# Altium schematic sheet E-19 WIFI_BT_802.15.4.SchDoc: FRDM-IMX93
size 513 x 386 mm; DrawnBy: FORLINX; Organization: ORGANIZATION; Address1: ADDRESS 1; Address2: ADDRESS 2; Address3: ADDRESS 3; Address4: ADDRESS 4; Revision: -; ENG_APP_DATE: --/--/--; DSN_APP_DATE: --/--/--; CHK_APP_DATE: --/--/--; Classification: Public, Company Internal/Proprietary, Company Confidential,  Company Secret; Page Create Date: March  8, 1995; OrgName: NXP Semiconductor; FIUO: A; OrgAddr1: NO. 192 Liangjing Rd. Pudong New Area, ShangHai; Page Number: 19; PageTitle: WIFI/BT/802.15.4; Page Size: C; Page Count: 23; Designer: FORLINX; RevCode: B1; Approver: NXP SE; Doc: SCH-94611 PDF: SPF-94611; DsnPath: T:\FILES\Designs\Single Board Computers\i.MX93-FRDM\Design Files\SCH-94611_B1.DSN; SchematicName: FRDM-i.MX 93 Development Board; PageName: E-19 WIFI/BT/802.15.4; PageSize: C; TopSchematic: True
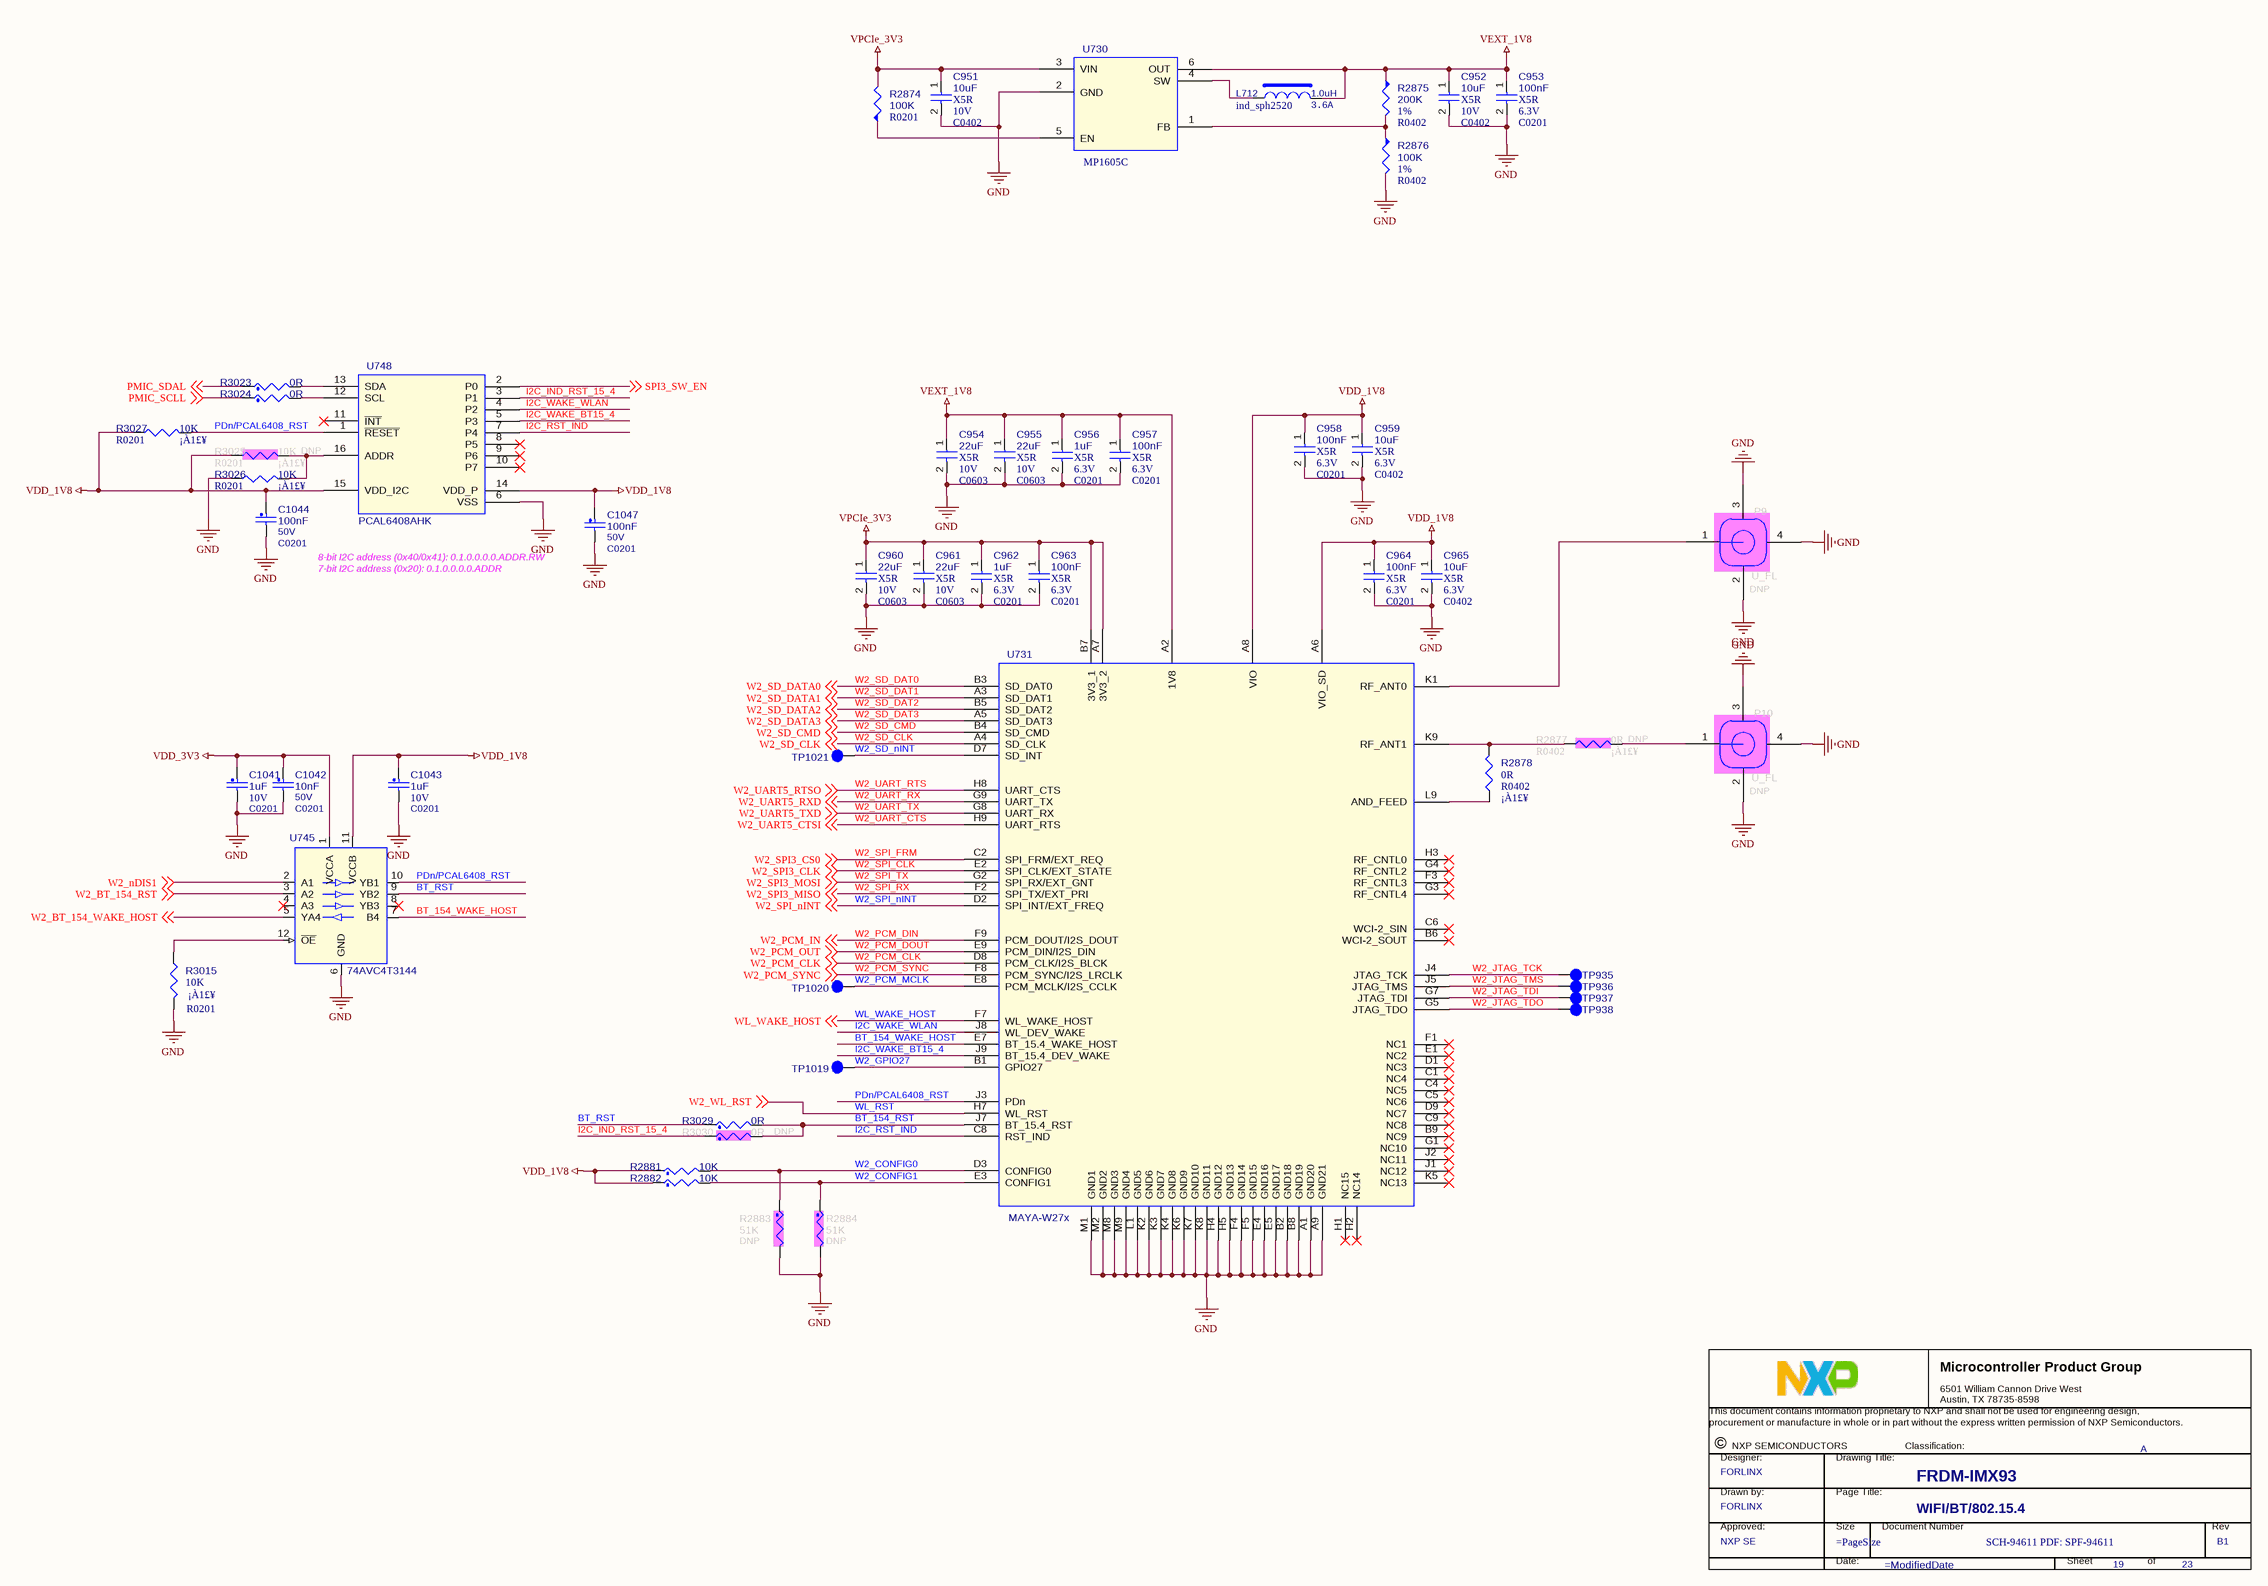
[diagram p0: E-19 WIFI_BT_802.15.4.SchDoc]

## Parts
*  Title: FRDM-IMX93  RevCode: B1  PageTitle: WIFI/BT/802.15.4  Page Number: 19  Page Count: 23  DrawnBy: FORLINX  Doc: SCH-94611 PDF: SPF-94611  Approver: NXP SE  FIUO: A  (graphical)
C951  10uF  Voltage: 10V  Dielectric: X5R  [C0402]
C952  10uF  Voltage: 10V  Dielectric: X5R  [C0402]
C953  100nF  Voltage: 6.3V  Dielectric: X5R  [C0201]
C954  22uF  Voltage: 10V  Dielectric: X5R  [C0603]
C955  22uF  Voltage: 10V  Dielectric: X5R  [C0603]
C956  1uF  Voltage: 6.3V  Dielectric: X5R  [C0201]
C957  100nF  Voltage: 6.3V  Dielectric: X5R  [C0201]
C958  100nF  Voltage: 6.3V  Dielectric: X5R  [C0201]
C959  10uF  Voltage: 6.3V  Dielectric: X5R  [C0402]
C960  22uF  Voltage: 10V  Dielectric: X5R  [C0603]
C961  22uF  Voltage: 10V  Dielectric: X5R  [C0603]
C962  1uF  Voltage: 6.3V  Dielectric: X5R  [C0201]
C963  100nF  Voltage: 6.3V  Dielectric: X5R  [C0201]
C964  100nF  Voltage: 6.3V  Dielectric: X5R  [C0201]
C965  10uF  Voltage: 6.3V  Dielectric: X5R  [C0402]
C1041  1uF  VOLTAGE: 10V  [C0201]
C1042  10nF  VOLTAGE: 50V  [C0201]
C1043  1uF  VOLTAGE: 10V  [C0201]
C1044  100nF  VOLTAGE: 50V  [C0201]
C1047  100nF  VOLTAGE: 50V  [C0201]
L712  1.0uH  Isat: 3.6A  [ind_sph2520]
P9  U_FL  ASSY_OPT: DNP  [IPEX_4]
P10  U_FL  ASSY_OPT: DNP  [IPEX_4]
R2874  100K  [R0201]
R2875  200K  Tolerance: 1%  [R0402]
R2876  100K  Tolerance: 1%  [R0402]
R2877  0R  precision: ¡À1£¥  ASSY_OPT: DNP  [R0402]
R2878  0R  precision: ¡À1£¥  [R0402]
R2881  10K  [R0201]
R2882  10K  [R0201]
R2883  51K  ASSY_OPT: DNP  [R0201]
R2884  51K  ASSY_OPT: DNP  [R0201]
R3015  10K  precision: ¡À1£¥  [R0201]
R3023  0R  [R0201]
R3024  0R  [R0201]
R3025  10K  precision: ¡À1£¥  ASSY_OPT: DNP  [R0201]
R3026  10K  precision: ¡À1£¥  [R0201]
R3027  10K  precision: ¡À1£¥  [R0201]
R3029  0R  [R0201]
R3030  0R  ASSY_OPT: DNP  [R0201]
TP935  TPAD_015  [tpad_015]  (value not drawn)
TP936  TPAD_015  [tpad_015]  (value not drawn)
TP937  TPAD_015  [tpad_015]  (value not drawn)
TP938  TPAD_015  [tpad_015]  (value not drawn)
TP1019  TPAD_015  [tpad_015]  (value not drawn)
TP1020  TPAD_015  [tpad_015]  (value not drawn)
TP1021  TPAD_015  [tpad_015]  (value not drawn)
U730  MP1605C  [SOT563]
U731  MAYA-W27x  [MAYA-W2]
U745  74AVC4T3144  [uqfn12_1p7x2mm]
U748  PCAL6408AHK  [XQFN16]

## Nets
GND: C951.2 C952.2 C953.2 C954.2 C955.2 C956.2 C957.2 C958.2 C959.2 C960.2 C961.2 C962.2 C963.2 C964.2 C965.2 C1041.2 C1042.2 C1043.2 C1044.2 C1047.2 P9.2 P9.3 P9.4 P10.2 P10.3 P10.4 R2876.2 R2883.2 R2884.2 R3015.2 R3026.1 U730.2(GND) U731.A1(GND20) U731.A9(GND21) U731.B2(GND18) U731.B8(GND19) U731.E4(GND16) U731.E5(GND17) U731.F4(GND14) U731.F5(GND15) U731.H4(GND12) U731.H5(GND13) U731.K2(GND6) U731.K3(GND7) U731.K4(GND8) U731.K6(GND9) U731.K7(GND10) U731.K8(GND11) U731.L1(GND5) U731.M1(GND1) U731.M2(GND2) U731.M8(GND3) U731.M9(GND4) U745.6(GND) U748.6(VSS)
VDD_1V8: C958.1 C959.1 C964.1 C965.1 C1043.1 C1044.1 C1047.1 R2881.1 R2882.1 R3025.1 R3027.1 U731.A6(VIO_SD) U731.A8(VIO) U745.11(VCCB) U748.14(VDD_P) U748.15(VDD_I2C)
VDD_3V3: C1041.1 C1042.1 U745.1(VCCA)
VEXT_1V8: C952.1 C953.1 C954.1 C955.1 C956.1 C957.1 L712.2 R2875.1 U730.6(OUT) U731.A2(1V8)
VPCIe_3V3: C951.1 C960.1 C961.1 C962.1 C963.1 R2874.2 U730.3(VIN) U731.A7(3V3_2) U731.B7(3V3_1)
BT_154_RST: R3029.2 R3030.2 U731.J7(BT_15.4_RST)
BT_154_WAKE_HOST: U731.E7(BT_15.4_WAKE_HOST) U745.7(B4)
BT_RST: R3029.1 U745.9(YB2)
I2C_IND_RST_15_4: R3030.1 U748.3(P1)
I2C_RST_IND: U731.C8(RST_IND) U748.7(P4)
I2C_WAKE_BT15_4: U731.J9(BT_15.4_DEV_WAKE) U748.5(P3)
I2C_WAKE_WLAN: U731.J8(WL_DEV_WAKE) U748.4(P2)
PDn/PCAL6408_RST: R3027.2 U731.J3(PDn) U745.10(YB1) U748.1(~{RESET})
PMIC_SCLL: R3024.1 ; off-sheet PMIC_SCLL
PMIC_SDAL: R3023.1 ; off-sheet PMIC_SDAL
SPI3_SW_EN: U748.2(P0) ; off-sheet SPI3_SW_EN
W2_BT_154_RST: U745.3(A2) ; off-sheet W2_BT_154_RST
W2_BT_154_WAKE_HOST: U745.5(YA4) ; off-sheet W2_BT_154_WAKE_HOST
W2_CONFIG0: R2881.2 R2883.1 U731.D3(CONFIG0)
W2_CONFIG1: R2882.2 R2884.1 U731.E3(CONFIG1)
W2_GPIO27: TP1019.1(Pin1) U731.B1(GPIO27)
W2_JTAG_TCK: TP935.1(Pin1) U731.J4(JTAG_TCK)
W2_JTAG_TDI: TP937.1(Pin1) U731.G7(JTAG_TDI)
W2_JTAG_TDO: TP938.1(Pin1) U731.G5(JTAG_TDO)
W2_JTAG_TMS: TP936.1(Pin1) U731.J5(JTAG_TMS)
W2_nDIS1: U745.2(A1) ; off-sheet W2_nDIS1
W2_PCM_CLK: U731.D8(PCM_CLK/I2S_BLCK) ; off-sheet W2_PCM_CLK
W2_PCM_DIN: U731.F9(PCM_DOUT/I2S_DOUT) ; off-sheet W2_PCM_IN  [also labelled W2_PCM_IN]
W2_PCM_DOUT: U731.E9(PCM_DIN/I2S_DIN) ; off-sheet W2_PCM_OUT  [also labelled W2_PCM_OUT]
W2_PCM_MCLK: TP1020.1(Pin1) U731.E8(PCM_MCLK/I2S_CCLK)
W2_PCM_SYNC: U731.F8(PCM_SYNC/I2S_LRCLK) ; off-sheet W2_PCM_SYNC
W2_SD_CLK: U731.A4(SD_CLK) ; off-sheet W2_SD_CLK
W2_SD_CMD: U731.B4(SD_CMD) ; off-sheet W2_SD_CMD
W2_SD_DAT0: U731.B3(SD_DAT0) ; off-sheet W2_SD_DATA0  [also labelled W2_SD_DATA0]
W2_SD_DAT1: U731.A3(SD_DAT1) ; off-sheet W2_SD_DATA1  [also labelled W2_SD_DATA1]
W2_SD_DAT2: U731.B5(SD_DAT2) ; off-sheet W2_SD_DATA2  [also labelled W2_SD_DATA2]
W2_SD_DAT3: U731.A5(SD_DAT3) ; off-sheet W2_SD_DATA3  [also labelled W2_SD_DATA3]
W2_SD_nINT: TP1021.1(Pin1) U731.D7(SD_INT)
W2_SPI_CLK: U731.E2(SPI_CLK/EXT_STATE) ; off-sheet W2_SPI3_CLK  [also labelled W2_SPI3_CLK]
W2_SPI_FRM: U731.C2(SPI_FRM/EXT_REQ) ; off-sheet W2_SPI3_CS0  [also labelled W2_SPI3_CS0]
W2_SPI_nINT: U731.D2(SPI_INT/EXT_FREQ) ; off-sheet W2_SPI_nINT
W2_SPI_RX: U731.F2(SPI_TX/EXT_PRI) ; off-sheet W2_SPI3_MISO  [also labelled W2_SPI3_MISO]
W2_SPI_TX: U731.G2(SPI_RX/EXT_GNT) ; off-sheet W2_SPI3_MOSI  [also labelled W2_SPI3_MOSI]
W2_UART_CTS: U731.H9(UART_RTS) ; off-sheet W2_UART5_CTSI  [also labelled W2_UART5_CTSI]
W2_UART_RTS: U731.H8(UART_CTS) ; off-sheet W2_UART5_RTSO  [also labelled W2_UART5_RTSO]
W2_UART_RX: U731.G9(UART_TX) ; off-sheet W2_UART5_RXD  [also labelled W2_UART5_RXD]
W2_UART_TX: U731.G8(UART_RX) ; off-sheet W2_UART5_TXD  [also labelled W2_UART5_TXD]
WL_RST: U731.H7(WL_RST) ; off-sheet W2_WL_RST  [also labelled W2_WL_RST]
WL_WAKE_HOST: U731.F7(WL_WAKE_HOST) ; off-sheet WL_WAKE_HOST
NetL712_1: L712.1 U730.4(SW)
NetP9_1: P9.1 U731.K1(RF_ANT0)
NetP10_1: P10.1 R2877.2
NetR2874_1: R2874.1 U730.5(EN)
NetR2875_2: R2875.2 R2876.1 U730.1(FB)
NetR2877_1: R2877.1 R2878.2 U731.K9(RF_ANT1)
NetR2878_1: R2878.1 U731.L9(AND_FEED)
NetR3015_1: R3015.1 U745.12(~{OE})
NetR3023_2: R3023.2 U748.13(SDA)
NetR3024_2: R3024.2 U748.12(SCL)
NetR3025_2: R3025.2 R3026.2 U748.16(ADDR)

Not connected (* = marked no-connect by the designer): U731 B6(WCI-2_SOUT)* B9(NC9)* C1(NC4)* C4(NC5)* C5(NC6)* C6(WCI-2_SIN)* C9(NC8)* D1(NC3)* D9(NC7)* E1(NC2)* F1(NC1)* F3(RF_CNTL3)* G1(NC10)* G3(RF_CNTL4)* G4(RF_CNTL2)* H1(NC15)* H2(NC14)* H3(RF_CNTL0)* J1(NC12)* J2(NC11)* K5(NC13)*; U745 4(A3)* 8(YB3)*; U748 8(P5)* 9(P6)* 10(P7)* 11(~{INT})*

## Notes on the sheet
- 8-bit I2C address (0x40/0x41): 0.1.0.0.0.0.ADDR.RW
- 7-bit I2C address (0x20): 0.1.0.0.0.0.ADDR
- DWG. NO.
- REV.
- SHT.
- REVISION
- DESCRIPTION
- DATE
- APPROVED
- ENG:
- APPROVALS
- quilter.ai <http://quilter.ai>
- DSN:
- CHK:
- REFERENCE DOCUMENTS
- TITLE
- PROJECT
- BOM:
- FAB DWG:
- PCB DWG:
- ASSY DWG:
- SIZE
- FILE NAME
- C
- DWG NO.
- SHEET
- OF
- REV
- (in symbol TitleBlock_MCPG) Microcontroller Product Group; 6501 William Cannon Drive West / Austin, TX 78735-8598; This document contains information proprietary to NXP and shall not be used for engineering design,; procurement or manufacture in whole or in part without the express written permission of NXP Semiconductors.; ©; NXP SEMICONDUCTORS; Classification:; Designer:; Drawing Title:; Drawn by:; Page Title:; Approved:; Size; Document Number; Rev; Date:; Sheet; of

## Library data of the parts
* = TitleBlock_MCPG: Classification: Public, Company Internal/Proprietary, Company Confidential,  Company Secret; OrgAddr1: NO. 192 Liangjing Rd. Pudong New Area, ShangHai; OrgName: NXP Semiconductor; Page Size: =PageSize; Page Create Date: March  8, 1995; Designer: FORLINX; Page Modify Date: =ModifiedDate
C951 = CAP NP: 0402,10uF,6.3V,+/-20%,X5R; Part Reference: C951; Manufacturer PN: GRM188R61A106MAAL; Manufacturer: murata; MFG_PN01: 0402X106M6R3NT; Tolerance: ¡À20%; Priority: A; RK PN: 902003487; MFG_NAME01: FENGHUA; PCB Footprint: C0402; Value: 10uF; Created by: JJJ; C_Voltage: 6.3V; Part Type: Ò»°ãÓÃÆ¬×´ÌÕ´ÉµçÈÝ
C952 = CAP NP: 0402,10uF,6.3V,+/-20%,X5R; Part Reference: C952; Manufacturer PN: GRM188R61A106MAAL; Manufacturer: murata; MFG_PN01: 0402X106M6R3NT; Tolerance: ¡À20%; Priority: A; RK PN: 902003487; MFG_NAME01: FENGHUA; PCB Footprint: C0402; Value: 10uF; Created by: JJJ; C_Voltage: 6.3V; Part Type: Ò»°ãÓÃÆ¬×´ÌÕ´ÉµçÈÝ
C953 = CAP NP: 0201,100nF,25V,+/-10%,X5R; Part Reference: C953; Manufacturer: FH(·ç»ª); Manufacturer PN: 0402X104K6R3NT; MFG_PN01: 0201X104K250NT; RK PN: 902004347; Priority: A; Tolerance: ¡À10%; MFG_NAME01: FENGHUA; PCB Footprint: C0201; Value: 100nF; Part Type: Ò»°ãÓÃÆ¬×´ÌÕ´ÉµçÈÝ; Created by: JJJ
C954 = CAP NP: 0603,22uF,6.3V,+/-20%,X5R; Part Reference: C954; Manufacturer PN: C2012X5R1A226K125AB; Manufacturer: TDK; MFG_PN01: CL10A226MQ8NRNC; Tolerance: 10%; Priority: A; MFG_NAME01: SAMSUNG; PCB Footprint: C0603; Value: 22uF; Created by: JJJ; C_Voltage: 6.3V; Part Type: C0805; RK PN: C2012X5R1A226K125AB
C955 = CAP NP: 0603,22uF,6.3V,+/-20%,X5R; Part Reference: C955; Manufacturer PN: C2012X5R1A226K125AB; Manufacturer: TDK; MFG_PN01: CL10A226MQ8NRNC; Tolerance: 10%; Priority: A; MFG_NAME01: SAMSUNG; PCB Footprint: C0603; Value: 22uF; Created by: JJJ; C_Voltage: 6.3V; Part Type: C0805; RK PN: C2012X5R1A226K125AB
C956 = CAP NP: 0201,1uF,10V,+/-20%,X5R; Part Reference: C956; Manufacturer PN: 0402X104K6R3NT; Manufacturer: FH(·ç»ª); MFG_PN01: CL03A105MP3NSNC; Tolerance: ¡À10%; Priority: A; RK PN: 902004347; MFG_NAME01: SAMSUNG; PCB Footprint: C0201; Value: 1uF; Created by: JJJ; Part Type: Ò»°ãÓÃÆ¬×´ÌÕ´ÉµçÈÝ
C957 = CAP NP: 0201,100nF,25V,+/-10%,X5R; Part Reference: C957; Manufacturer: FH(·ç»ª); Manufacturer PN: 0402X104K6R3NT; MFG_PN01: 0201X104K250NT; RK PN: 902004347; Priority: A; Tolerance: ¡À10%; MFG_NAME01: FENGHUA; PCB Footprint: C0201; Value: 100nF; Part Type: Ò»°ãÓÃÆ¬×´ÌÕ´ÉµçÈÝ; Created by: JJJ
C958 = CAP NP: 0201,100nF,25V,+/-10%,X5R; Part Reference: C958; Manufacturer PN: 0402X104K6R3NT; Manufacturer: FH(·ç»ª); MFG_PN01: 0201X104K250NT; Tolerance: ¡À10%; Priority: A; RK PN: 902004347; MFG_NAME01: FENGHUA; PCB Footprint: C0201; Value: 100nF; Created by: JJJ; Part Type: Ò»°ãÓÃÆ¬×´ÌÕ´ÉµçÈÝ
C959 = CAP NP: 0402,10uF,6.3V,+/-20%,X5R; Part Reference: C959; Manufacturer PN: 0402X104K6R3NT; Manufacturer: FH(·ç»ª); MFG_PN01: 0402X106M6R3NT; Tolerance: ¡À10%; Priority: A; RK PN: 902004347; MFG_NAME01: FENGHUA; PCB Footprint: C0402; Value: 10uF; Created by: JJJ; Part Type: Ò»°ãÓÃÆ¬×´ÌÕ´ÉµçÈÝ
C960 = CAP NP: 0603,22uF,6.3V,+/-20%,X5R; Part Reference: C960; Manufacturer PN: C2012X5R1A226K125AB; Manufacturer: TDK; MFG_PN01: CL10A226MQ8NRNC; Tolerance: 10%; Priority: A; MFG_NAME01: SAMSUNG; PCB Footprint: C0603; Value: 22uF; Created by: JJJ; C_Voltage: 6.3V; Part Type: C0805; RK PN: C2012X5R1A226K125AB
C961 = CAP NP: 0603,22uF,6.3V,+/-20%,X5R; Part Reference: C961; Manufacturer PN: C2012X5R1A226K125AB; Manufacturer: TDK; MFG_PN01: CL10A226MQ8NRNC; Tolerance: 10%; Priority: A; MFG_NAME01: SAMSUNG; PCB Footprint: C0603; Value: 22uF; Created by: JJJ; C_Voltage: 6.3V; Part Type: C0805; RK PN: C2012X5R1A226K125AB
C962 = CAP NP: 0201,1uF,10V,+/-20%,X5R; Part Reference: C962; Manufacturer: FH(·ç»ª); Manufacturer PN: 0402X104K6R3NT; MFG_PN01: CL03A105MP3NSNC; RK PN: 902004347; Priority: A; Tolerance: ¡À10%; MFG_NAME01: SAMSUNG; PCB Footprint: C0201; Value: 1uF; Part Type: Ò»°ãÓÃÆ¬×´ÌÕ´ÉµçÈÝ; Created by: JJJ
C963 = CAP NP: 0201,100nF,25V,+/-10%,X5R; Part Reference: C963; Manufacturer: FH(·ç»ª); Manufacturer PN: 0402X104K6R3NT; MFG_PN01: 0201X104K250NT; RK PN: 902004347; Priority: A; Tolerance: ¡À10%; MFG_NAME01: FENGHUA; PCB Footprint: C0201; Value: 100nF; Part Type: Ò»°ãÓÃÆ¬×´ÌÕ´ÉµçÈÝ; Created by: JJJ
C964 = CAP NP: 0201,100nF,25V,+/-10%,X5R; Part Reference: C964; Manufacturer PN: 0402X104K6R3NT; Manufacturer: FH(·ç»ª); MFG_PN01: 0201X104K250NT; Tolerance: ¡À10%; Priority: A; RK PN: 902004347; MFG_NAME01: FENGHUA; PCB Footprint: C0201; Value: 100nF; Created by: JJJ; Part Type: Ò»°ãÓÃÆ¬×´ÌÕ´ÉµçÈÝ
C965 = CAP NP: 0402,10uF,6.3V,+/-20%,X5R; Part Reference: C965; Manufacturer PN: 0402X104K6R3NT; Manufacturer: FH(·ç»ª); MFG_PN01: 0402X106M6R3NT; Tolerance: ¡À10%; Priority: A; RK PN: 902004347; MFG_NAME01: FENGHUA; PCB Footprint: C0402; Value: 10uF; Created by: JJJ; Part Type: Ò»°ãÓÃÆ¬×´ÌÕ´ÉµçÈÝ
C1041 = CAP_NP: 0201,1uF,10V,+/-20%,X5R; Part Reference: C1041; CLASS: DISCRETE; TOL: 10%; FPLIST: CC0402_25,CC0402_HD,0402_CC,capc0402_l; CAD_APPROVED: Yes; MFG_PN01: CL03A105MP3NSNC; MFG_NAME01: SAMSUNG; SIGNAL_MODEL: DEFAULT_CAPACITOR_1e+06pF_2_1; Value: 1uF; PCB Footprint: C0201; voltage rating: 10V; HEIGHT: 0.55 MM; ROHS: Yes; Tolerance: 10%
C1042 = CAP_NP: 0201,10nF,25V,+/-10%,X7R; Part Reference: C1042; CLASS: DISCRETE; FPLIST: CC0402_25,CC0402_HD,0402_CC; CAD_APPROVED: Yes; MFG_PN01: 0201B103K250NT; MFG_NAME01: FENGHUA; Tolerance: 10%; Value: 10nF; PCB Footprint: C0201; HEIGHT: 0.74 MM; ROHS: Yes
C1043 = CAP_NP: 0201,1uF,10V,+/-20%,X5R; Part Reference: C1043; CLASS: DISCRETE; TOL: 10%; FPLIST: CC0402_25,CC0402_HD,0402_CC,capc0402_l; CAD_APPROVED: Yes; MFG_PN01: CL03A105MP3NSNC; MFG_NAME01: SAMSUNG; SIGNAL_MODEL: DEFAULT_CAPACITOR_1e+06pF_2_1; Value: 1uF; PCB Footprint: C0201; voltage rating: 10V; HEIGHT: 0.55 MM; ROHS: Yes; Tolerance: 10%
C1044 = CAP_NP: 0201,100nF,25V,+/-10%,X5R; Part Reference: C1044; CLASS: DISCRETE; Tolerance: 10%; MFG_NAME01: FENGHUA; MFG_PN01: 0201X104K250NT; CAD_APPROVED: Yes; FPLIST: CC0402_25,CC0402_HD,0402_CC; Value: 100nF; PCB Footprint: C0201; ROHS: Yes; HEIGHT: 0.74 MM
C1047 = CAP_NP: 0201,100nF,25V,+/-10%,X5R; Part Reference: C1047; CLASS: DISCRETE; FPLIST: CC0402_25,CC0402_HD,0402_CC; CAD_APPROVED: Yes; MFG_PN01: 0201X104K250NT; MFG_NAME01: FENGHUA; Tolerance: 10%; Value: 100nF; PCB Footprint: C0201; HEIGHT: 0.74 MM; ROHS: Yes
L712 = INDUCTORS OF FERRITE: 1uH ,2.5*2.0*1.2mm, 3.6A; Part Reference: L712; Manufacturer: TDK; DC Resistor: 0.065ohm; MFG_PN01: WPN252012H1R0MT; RK PN: VLS252010HBX-1R0M; Priority: A; Tolerance: 20%; Irms: 2.55A; Resonace frequency: 1MHz; MFG_NAME01: Sunlord; PCB Footprint: ind_sph2520; Value: 1.0uH; Part Type: IND; Manufacturer PN: VLS252010HBX-1R0M; Created by: JJJ
P9 = U_FL: IPEX transposon, 4th generation; Part Reference: P9; MFG_PN01: IPEX-4; MFG_NAME01: IPES; Value: U_FL; PCB Footprint: IPEX_4
P10 = U_FL: IPEX transposon, 4th generation; Part Reference: P10; MFG_PN01: IPEX-4; MFG_NAME01: IPES; Value: U_FL; PCB Footprint: IPEX_4
R2874 = RESISTOR5: 0201,100K,+/-1%; Part Reference: R2874; Manufacturer: YAGEO; Manufacturer PN: RC0402JR-07100KL; Tolerance: 5%; MFG_PN01: RC-01W1003FT; RK PN: 901001447; Priority: A; Wattage: 1/16W; MFG_NAME01: FENGHUA; PCB Footprint: R0201; Value: 100K; Part Type: Í¨ÓÃºñÄ¤µç×è; Created by: YTL
R2875 = RESISTOR1: 0402,200K,+/-1%; Part Reference: R2875; Manufacturer PN: RC0402FR-07249KL; Manufacturer: YAGEO; MFG_PN01: RC-02K2003FT; Wattage: 1/16W; Priority: A; RK PN: 901000996; MFG_NAME01: FENGHUA; PCB Footprint: R0402; Value: 200K; Created by: YTL; Part Type: Í¨ÓÃºñÄ¤µç×è
R2876 = RESISTOR1: 0402,100K,+/-1%; Part Reference: R2876; Manufacturer PN: RC0402FR-07249KL; Manufacturer: YAGEO; MFG_PN01: RC-02K1003FT; Wattage: 1/16W; Priority: A; RK PN: 901000996; MFG_NAME01: FENGHUA; PCB Footprint: R0402; Value: 100K; Created by: YTL; Part Type: Í¨ÓÃºñÄ¤µç×è
R2877 = R0402,4.7K: 0402,0Ohm,+/-1%; Part Reference: R2877; serial number: 1110102015; MFG_PN01: RC-02000FT; MFG_NAME01: FENGHUA; PCB Footprint: R0402; Value: 0R
R2878 = R0402,4.7K: 0402,0Ohm,+/-1%; Part Reference: R2878; serial number: 1110102015; MFG_PN01: RC-02000FT; MFG_NAME01: FENGHUA; PCB Footprint: R0402; Value: 0R
R2881 = RES: 0201,10K,+/-5%; Part Reference: R2881; CLASS: DISCRETE; FPLIST: RC0402_25,RC0402_HD,RC0402_X2,0402_CC; CAD_APPROVED: Yes; MFG_PN01: RC-01W103JT; MFG_NAME01: FENGHUA; Tolerance: 5%; VOLTAGE: 1/16W; Value: 10K; PCB Footprint: R0201; ROHS: Yes; HEIGHT: 0.45 MM
R2882 = RES: 0201,10K,+/-5%; Part Reference: R2882; CLASS: DISCRETE; FPLIST: RC0402_25,RC0402_HD,RC0402_X2,0402_CC; CAD_APPROVED: Yes; MFG_PN01: RC-01W103JT; MFG_NAME01: FENGHUA; Tolerance: 5%; VOLTAGE: 1/16W; Value: 10K; PCB Footprint: R0201; ROHS: Yes; HEIGHT: 0.45 MM
R2883 = RES: 0201,51K,+/-1%,RC-01W5102FT; Part Reference: R2883; CLASS: DISCRETE; FPLIST: RC0402_25,RC0402_HD,RC0402_X2,0402_CC; CAD_APPROVED: Yes; MFG_NAME01: FENGHUA; Tolerance: 5%; VOLTAGE: 1/16W; Value: 51K; PCB Footprint: R0201; ROHS: Yes; MFG_PN01: RC-01W5102FT; HEIGHT: 0.45 MM
R2884 = RES: 0201,51K,+/-1%,RC-01W5102FT; Part Reference: R2884; CLASS: DISCRETE; VOLTAGE: 1/16W; Tolerance: 5%; MFG_NAME01: FENGHUA; CAD_APPROVED: Yes; FPLIST: RC0402_25,RC0402_HD,RC0402_X2,0402_CC; Value: 51K; PCB Footprint: R0201; HEIGHT: 0.45 MM; MFG_PN01: RC-01W5102FT; ROHS: Yes
R3015 = R0402,10K: 0201,10K,+/-5%; Part Reference: R3015; serial number: 1110102037; MFG_PN01: RC-01W103JT; MFG_NAME01: FENGHUA; PCB Footprint: R0201; Value: 10K
R3023 = RES: 0201,0Ohm,+/-5%; Part Reference: R3023; CLASS: DISCRETE; FPLIST: RC0402_25,RC0402_HD,RC0402_X2,0402_CC; CAD_APPROVED: Yes; MFG_PN01: RC-01000JT; MFG_NAME01: FENGHUA; Tolerance: 5%; VOLTAGE: 1/16W; Value: 0R; PCB Footprint: R0201; ROHS: Yes; HEIGHT: 0.45 MM
R3024 = RES: 0201,0Ohm,+/-5%; Part Reference: R3024; CLASS: DISCRETE; FPLIST: RC0402_25,RC0402_HD,RC0402_X2,0402_CC; CAD_APPROVED: Yes; MFG_PN01: RC-01000JT; MFG_NAME01: FENGHUA; Tolerance: 5%; VOLTAGE: 1/16W; Value: 0R; PCB Footprint: R0201; ROHS: Yes; HEIGHT: 0.45 MM
R3025 = R0402,10K: 0201,10K,+/-5%; Part Reference: R3025; serial number: 1110102037; MFG_PN01: RC-01W103JT; MFG_NAME01: FENGHUA; PCB Footprint: R0201; Value: 10K
R3026 = R0402,10K: 0201,10K,+/-5%; Part Reference: R3026; serial number: 1110102037; MFG_PN01: RC-01W103JT; MFG_NAME01: FENGHUA; PCB Footprint: R0201; Value: 10K
R3027 = R0402,10K: 0201,10K,+/-5%; Part Reference: R3027; serial number: 1110102037; MFG_PN01: RC-01W103JT; MFG_NAME01: FENGHUA; PCB Footprint: R0201; Value: 10K
R3029 = RES: 0201,0Ohm,+/-5%; Part Reference: R3029; CLASS: DISCRETE; FPLIST: RC0402_25,RC0402_HD,RC0402_X2,0402_CC; CAD_APPROVED: Yes; MFG_PN01: RC-01000JT; MFG_NAME01: FENGHUA; Tolerance: 5%; VOLTAGE: 1/16W; Value: 0R; PCB Footprint: R0201; ROHS: Yes; HEIGHT: 0.45 MM
R3030 = RES: 0201,0Ohm,+/-5%; Part Reference: R3030; CLASS: DISCRETE; FPLIST: RC0402_25,RC0402_HD,RC0402_X2,0402_CC; CAD_APPROVED: Yes; MFG_PN01: RC-01000JT; MFG_NAME01: FENGHUA; Tolerance: 5%; VOLTAGE: 1/16W; Value: 0R; PCB Footprint: R0201; ROHS: Yes; HEIGHT: 0.45 MM
TP935 = TESTLOOP: no part to order; Part Reference: TP935; CLASS: IO; ASSY_OPT: DNP; CAD_APPROVED: Yes; MFG_PN01: NOT A COMPONENT; PCB Footprint: tpad_015; HEIGHT: 0.1MM; ROHS: Yes; MFG_NAME01: NOT A COMPONENT
TP936 = TESTLOOP: no part to order; Part Reference: TP936; CLASS: IO; ASSY_OPT: DNP; CAD_APPROVED: Yes; MFG_PN01: NOT A COMPONENT; PCB Footprint: tpad_015; HEIGHT: 0.1MM; ROHS: Yes; MFG_NAME01: NOT A COMPONENT
TP937 = TESTLOOP: no part to order; Part Reference: TP937; CLASS: IO; ASSY_OPT: DNP; CAD_APPROVED: Yes; MFG_PN01: NOT A COMPONENT; PCB Footprint: tpad_015; HEIGHT: 0.1MM; ROHS: Yes; MFG_NAME01: NOT A COMPONENT
TP938 = TESTLOOP: no part to order; Part Reference: TP938; CLASS: IO; ASSY_OPT: DNP; CAD_APPROVED: Yes; MFG_PN01: NOT A COMPONENT; PCB Footprint: tpad_015; HEIGHT: 0.1MM; ROHS: Yes; MFG_NAME01: NOT A COMPONENT
TP1019 = TESTLOOP: no part to order; Part Reference: TP1019; CLASS: IO; ASSY_OPT: DNP; CAD_APPROVED: Yes; MFG_PN01: NOT A COMPONENT; PCB Footprint: tpad_015; HEIGHT: 0.1MM; ROHS: Yes; MFG_NAME01: NOT A COMPONENT
TP1020 = TESTLOOP: no part to order; Part Reference: TP1020; CLASS: IO; ASSY_OPT: DNP; CAD_APPROVED: Yes; MFG_PN01: NOT A COMPONENT; PCB Footprint: tpad_015; HEIGHT: 0.1MM; ROHS: Yes; MFG_NAME01: NOT A COMPONENT
TP1021 = TESTLOOP: no part to order; Part Reference: TP1021; CLASS: IO; ASSY_OPT: DNP; MFG_NAME01: NOT A COMPONENT; CAD_APPROVED: Yes; PCB Footprint: tpad_015; MFG_PN01: NOT A COMPONENT; ROHS: Yes; HEIGHT: 0.1MM
U730 = MP1605C: MP1605GTF,SOT563; Part Reference: U730; MFG_NAME01: MPS; Value: MP1605C; PCB Footprint: SOT563; MFG_PN01: MP1605GTF
U731 = MAYA-W27x: MAYA-W276,LGA86,10.4*14.3*2.0mm,0-70+C(SDIO,UART,SPI); Part Reference: U731; MFG_NAME01: Ublox; Value: MAYA-W27x; MFG_PN01: MAYA-W276; PCB Footprint: MAYA-W2
U745 = TXB0304RUT_12P_B_0: 74AVC4T3144GU12,XQFN12,1.70*2.0,4-bit dual-supply buffer/level translator;3-state; Part Reference: U745; CLASS: IC; 3D_Mechanical_Footprint_File: ftp://fcl.am.freescale.net/ALLEGRO/step/uqfn12_1p7x2mm.STEP; MFG_NAME01: NXP; VOLTAGE: 0.9-3.6V; CAD_APPROVED: Yes; Value: 74AVC4T3144; PCB Footprint: uqfn12_1p7x2mm; MFG_PN01: 74AVC4T3144; ROHS: Yes; HEIGHT: 0.55 MM
U748 = PCAL6408AHK: PCAL6408AHK,XQFN16,-40~85+C,I2C Extended 8-bit GPIO; Part Reference: U748; MFG_NAME01: NXP; Value: PCAL6408AHK; PCB Footprint: XQFN16; MFG_PN01: PCAL6408AHK